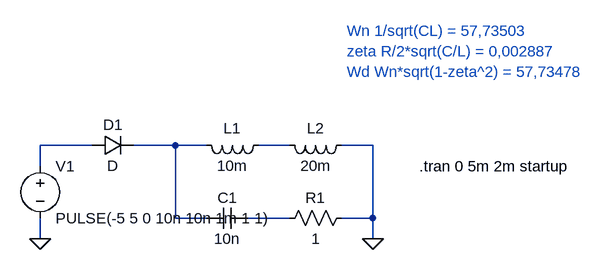
[diagram p0: schematic LCTank.asc]
LCTank.asc, the LTspice schematic file:
Version 4
SHEET 1 880 680
WIRE -192 96 -272 96
WIRE -64 96 -128 96
WIRE -16 96 -64 96
WIRE 112 96 64 96
WIRE 240 96 192 96
WIRE -272 128 -272 96
WIRE -64 208 -64 96
WIRE -16 208 -64 208
WIRE 112 208 48 208
WIRE 240 208 240 96
WIRE 240 208 192 208
WIRE -272 240 -272 208
WIRE 240 240 240 208
FLAG 240 240 0
FLAG -272 240 0
SYMBOL cap 48 192 R90
WINDOW 0 0 32 VBottom 2
WINDOW 3 32 32 VTop 2
SYMATTR InstName C1
SYMATTR Value 10n
SYMBOL ind 80 80 R90
WINDOW 0 5 56 VBottom 2
WINDOW 3 32 56 VTop 2
SYMATTR InstName L1
SYMATTR Value 10m
SYMBOL ind 208 80 R90
WINDOW 0 5 56 VBottom 2
WINDOW 3 32 56 VTop 2
SYMATTR InstName L2
SYMATTR Value 20m
SYMBOL res 208 192 R90
WINDOW 0 0 56 VBottom 2
WINDOW 3 32 56 VTop 2
SYMATTR InstName R1
SYMATTR Value 1
SYMBOL voltage -272 112 R0
WINDOW 123 0 0 Left 0
WINDOW 39 0 0 Left 0
SYMATTR InstName V1
SYMATTR Value PULSE(-5 5 0 10n 10n 1m 1 1)
SYMBOL diode -192 112 R270
WINDOW 0 32 32 VTop 2
WINDOW 3 0 32 VBottom 2
SYMATTR InstName D1
TEXT 200 -80 Left 2 ;Wn 1/sqrt(CL) = 57,73503\nzeta R/2*sqrt(C/L) = 0,002887\nWd Wn*sqrt(1-zeta^2) = 57,73478
TEXT 312 128 Left 2 !.tran 0 5m 2m startup

The netlist it stands for:
* LCTank.asc
C1 N004 N002 10n
L1 N003 N002 10m
L2 0 N003 20m
R1 0 N004 1
V1 N001 0 PULSE(-5 5 0 10n 10n 1m 1 1)
D1 N001 N002 D
.model D D
.lib standard.dio
* Wn 1/sqrt(CL) = 57,73503
* zeta R/2*sqrt(C/L) = 0,002887
* Wd Wn*sqrt(1-zeta^2) = 57,73478
.tran 0 5m 2m startup
.backanno
.end